# EAGLE design adapter 7seg_3dig (EAGLE 5.06)
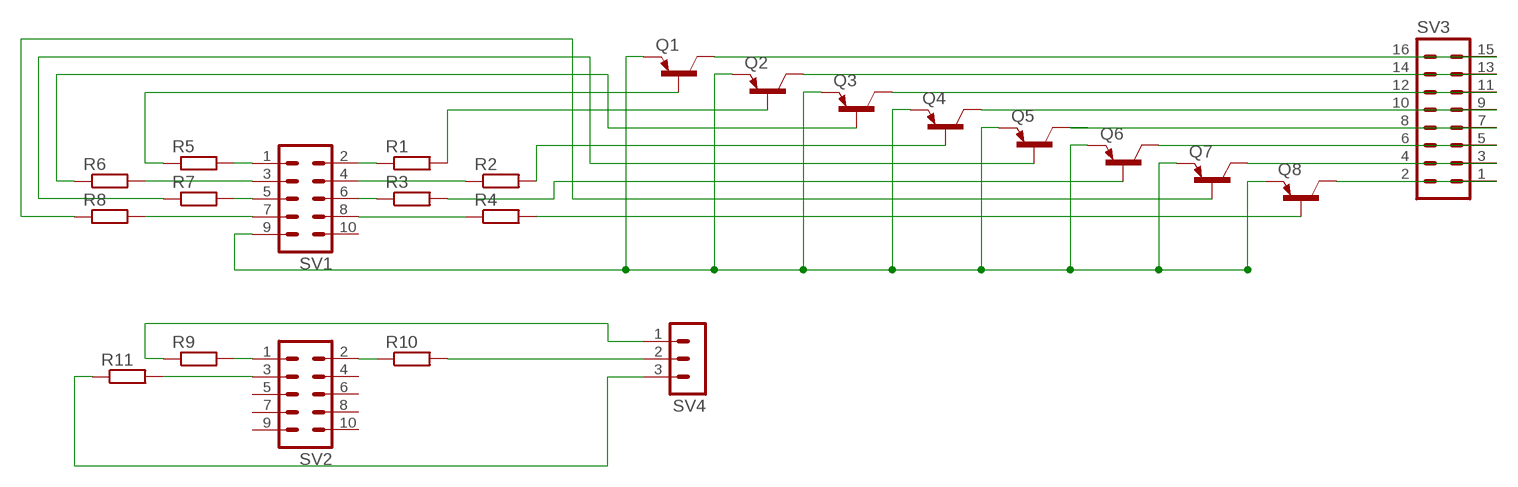
[diagram p0: schematic, sheet 1]

## Parts
Q1  BC807-16LT1SMD  [SOT23-BEC]
Q2  BC807-16LT1SMD  [SOT23-BEC]
Q3  BC807-16LT1SMD  [SOT23-BEC]
Q4  BC807-16LT1SMD  [SOT23-BEC]
Q5  BC807-16LT1SMD  [SOT23-BEC]
Q6  BC807-16LT1SMD  [SOT23-BEC]
Q7  BC807-16LT1SMD  [SOT23-BEC]
Q8  BC807-16LT1SMD  [SOT23-BEC]
R1  R-EU_R0805  [R0805]
R2  R-EU_R0805  [R0805]
R3  R-EU_R0805  [R0805]
R4  R-EU_R0805  [R0805]
R5  R-EU_R0805  [R0805]
R6  R-EU_R0805  [R0805]
R7  R-EU_R0805  [R0805]
R8  R-EU_R0805  [R0805]
R9  R-EU_R0805  [R0805]
R10  R-EU_R0805  [R0805]
R11  R-EU_R0805  [R0805]
SV1  MA05-2  [MA05-2]
SV2  MA05-2  [MA05-2]
SV3  MA08-2  [MA08-2]
SV4  MA03-1  [MA03-1]

## Nets
N$1: R5.2 SV1.1
N$2: R6.2 SV1.3
N$3: R7.2 SV1.5
N$4: R8.2 SV1.7
N$5: R1.1 SV1.2
N$6: R2.1 SV1.4
N$7: R3.1 SV1.6
N$8: R4.1 SV1.8
N$9: Q1.B R5.1
N$10: Q2.B R1.2
N$11: Q3.B R6.1
N$12: Q4.B R2.2
N$13: Q5.B R7.1
N$14: Q6.B R3.2
N$15: Q7.B R8.1
N$16: Q8.B R4.2
N$17: Q1.E Q2.E Q3.E Q4.E Q5.E Q6.E Q7.E Q8.E SV1.9
N$18: Q1.C SV3.15 SV3.16
N$19: Q2.C SV3.13 SV3.14
N$20: Q3.C SV3.11 SV3.12
N$21: Q4.C SV3.9 SV3.10
N$22: Q5.C SV3.7 SV3.8
N$23: Q6.C SV3.5 SV3.6
N$24: Q7.C SV3.3 SV3.4
N$25: Q8.C SV3.1 SV3.2
N$26: R9.2 SV2.1
N$27: R9.1 SV4.1
N$28: R10.1 SV2.2
N$29: R10.2 SV4.2
N$30: R11.2 SV2.3
N$31: R11.1 SV4.3
Unconnected: SV1.10 SV2.4 SV2.5 SV2.6 SV2.7 SV2.8 SV2.9 SV2.10

## Library data of the parts
Q1-Q8 = transistor-pnp:BC807*: PNP Transistror
R1-R11 = rcl:R-EU_: RESISTOR, European symbol
SV1 SV2 = con-lstb:MA05-2: PIN HEADER
SV3 = con-lstb:MA08-2: PIN HEADER
SV4 = con-lstb:MA03-1: PIN HEADER

## Board
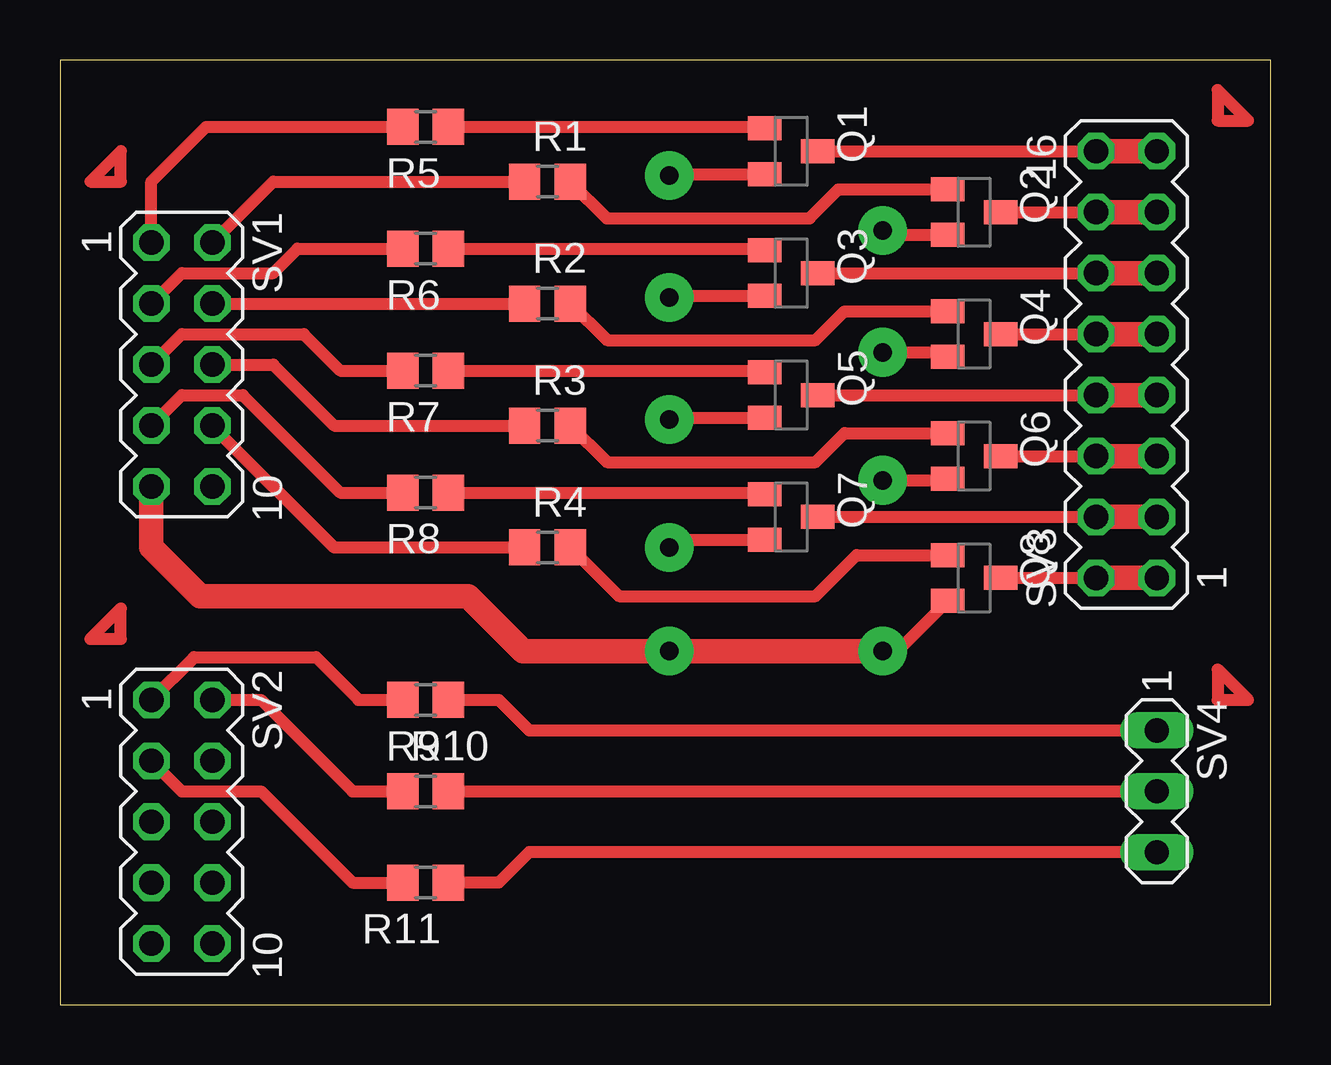
[diagram p1: board, top side]
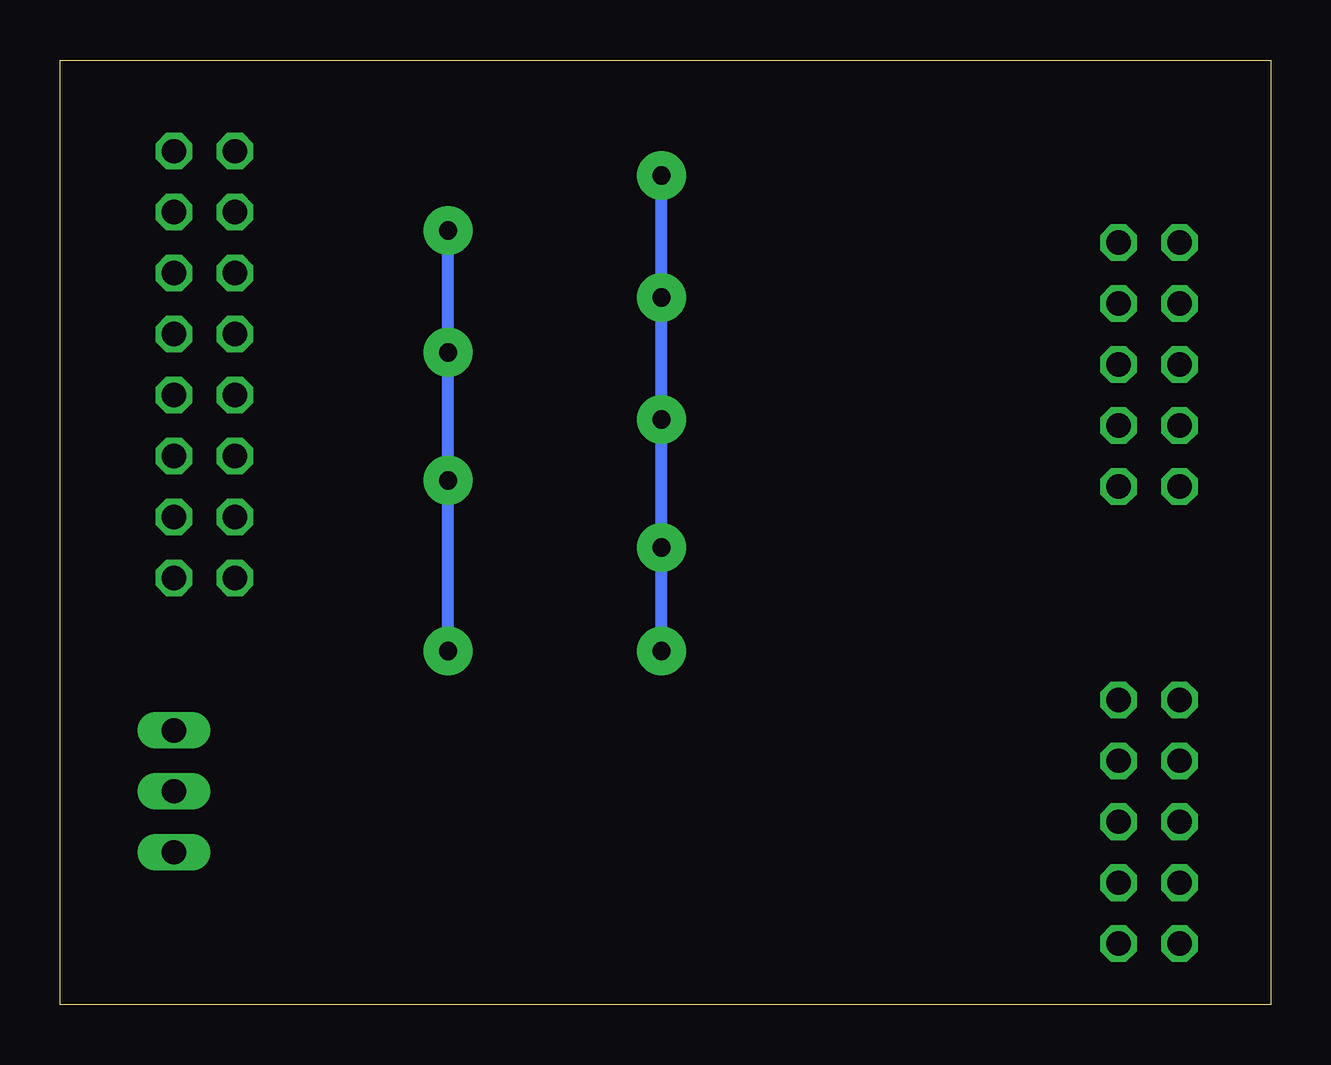
[diagram p2: board, bottom side, seen from below]

Size 50.47 x 39.36 mm. Coordinates in mm from the lower left corner, seen from the top.
Outline: 0,0 50.47,0 50.47,39.36 0,39.36 0,0
Copper layers (1*16): Top 0.035mm / dielectric 1.5mm / Bottom 0.035mm
Design rules "default": minimum track width 10mil, minimum drill 24mil, track to track 8mil, track to pad 8mil, pad to pad 8mil, via to via 8mil, smd to smd 8mil, copper to edge 40mil, drill to drill 8mil, minimum pad ring 10mil, minimum via ring 8mil, stop-mask expansion 4mil, vias tented up to drill 0mil, thermal gap 10mil

### Footprints (pad centres in the part's own frame; a part is rotated, then mirrored left to right if it is on the bottom)
SOT23-BEC = smd 1 x 1.4: B -0.95,-1.1; C 0,1.1; E 0.95,-1.1
R0805 = smd 1.3 x 1.5: 1 -0.95,0; 2 0.95,0
MA05-2 = drill 1.016 octagon: 1 -5.08,-1.27; 2 -5.08,1.27; 3 -2.54,-1.27; 4 -2.54,1.27; 5 0,-1.27; 6 0,1.27; 7 2.54,-1.27; 8 2.54,1.27; 9 5.08,-1.27; 10 5.08,1.27
MA08-2 = drill 1.016 octagon: 1 -8.89,-1.27; 2 -8.89,1.27; 3 -6.35,-1.27; 4 -6.35,1.27; 5 -3.81,-1.27; 6 -3.81,1.27; 7 -1.27,-1.27; 8 -1.27,1.27; 9 1.27,-1.27; 10 1.27,1.27; 11 3.81,-1.27; 12 3.81,1.27; 13 6.35,-1.27; 14 6.35,1.27; 15 8.89,-1.27; 16 8.89,1.27
MA03-1 = drill 1.016 long: 1 -2.54,0; 2 0,0; 3 2.54,0

### Placement (x,y rotation side)
Q1  30.48,35.56 270 top
Q2  38.1,33.02 270 top
Q3  30.48,30.48 270 top
Q4  38.1,27.94 270 top
Q5  30.48,25.4 270 top
Q6  38.1,22.86 270 top
Q7  30.48,20.32 270 top
Q8  38.1,17.78 270 top
R1  20.32,34.29 0 top
R2  20.32,29.21 0 top
R3  20.32,24.13 0 top
R4  20.32,19.05 0 top
R5  15.24,36.58 180 top
R6  15.24,31.5 180 top
R7  15.24,26.42 180 top
R8  15.24,21.34 180 top
R9  15.24,12.7 180 top
R10  15.24,8.89 0 top
R11  15.24,5.08 180 top
SV1  5.08,26.67 270 top
SV2  5.08,7.62 270 top
SV3  44.45,26.67 90 top
SV4  45.72,8.89 270 top

### Tracks (layer width: path | path; a pad name or v marks a point on that pad's centre or on a via)
N$1
  Top 0.508: SV1.1 3.81,34.29 6.1,36.58 R5.2
N$2
  Top 0.508: SV1.3 5.08,30.48 8.89,30.48 9.91,31.5 R6.2
N$3
  Top 0.508: SV1.5 5.08,27.94 10.16,27.94 11.68,26.42 R7.2
N$4
  Top 0.508: SV1.7 5.08,25.4 7.62,25.4 11.68,21.34 R8.2
N$5
  Top 0.508: SV1.2 8.89,34.29 R1.1
N$6
  Top 0.508: SV1.4 R2.1
N$7
  Top 0.508: SV1.6 8.89,26.67 11.43,24.13 R3.1
N$8
  Top 0.508: SV1.8 11.43,19.05 R4.1
N$9
  Top 0.508: R5.1 29.31,36.58 Q1.B
N$10
  Top 0.508: R1.2 22.79,32.77 31.24,32.77 32.45,33.97 Q2.B
N$11
  Top 0.508: R6.1 29.31,31.5 Q3.B
N$12
  Top 0.508: R2.2 22.79,27.69 31.5,27.69 32.7,28.89 Q4.B
N$13
  Top 0.508: R7.1 29.31,26.42 Q5.B
N$14
  Top 0.508: R3.2 22.79,22.61 31.5,22.61 32.7,23.81 Q6.B
N$15
  Top 0.508: R8.1 29.31,21.34 Q7.B
N$16
  Top 0.508: R4.2 23.3,17.02 31.5,17.02 33.21,18.73 Q8.B
N$17  (via drill 0.76 pad 2.03)
  Top 0.508: 3.81,21.34 SV1.9 | Q1.E 25.47,34.61 v25.4,34.54 | Q3.E 25.47,29.53 v25.4,29.46 | Q5.E 25.47,24.45 v25.4,24.38 | Q7.E 25.72,19.37 v25.4,19.05 | 19.3,14.73 v25.4,14.73 v34.29,14.73 34.54,14.73 34.9,14.73 Q8.E | Q2.E 34.48,32.07 v34.29,32.26 | Q4.E 37,27.18 v34.29,27.18 | Q6.E 37,21.84 v34.29,21.84
  Top 1.016: 3.81,21.34 3.81,19.05 5.84,17.02 17.02,17.02 19.3,14.73 34.54,14.73
  Bottom 0.508: v25.4,14.73 v25.4,19.05 v25.4,24.38 v25.4,29.46 v25.4,34.54 | v34.29,14.73 v34.29,21.84 v34.29,27.18 v34.29,32.26
N$18
  Top 0.508: Q1.C SV3.16 SV3.15
  Top 1.016: SV3.15 SV3.16
N$19
  Top 0.508: Q2.C SV3.14 SV3.13
  Top 1.016: SV3.14 SV3.13
N$20
  Top 0.508: Q3.C SV3.12 SV3.11
  Top 1.016: SV3.12 SV3.11
N$21
  Top 0.508: Q4.C SV3.10 SV3.9
  Top 1.016: SV3.10 SV3.9
N$22
  Top 0.508: Q5.C SV3.8 SV3.7
  Top 1.016: SV3.8 SV3.7
N$23
  Top 0.508: Q6.C SV3.6 SV3.5
  Top 1.016: SV3.6 SV3.5
N$24
  Top 0.508: Q7.C SV3.4 SV3.3
  Top 1.016: SV3.4 SV3.3
N$25
  Top 0.508: Q8.C SV3.2 SV3.1
  Top 1.016: SV3.2 SV3.1
N$26
  Top 0.508: SV2.1 5.59,14.48 10.67,14.48 12.45,12.7 R9.2
N$27
  Top 0.508: R9.1 18.29,12.7 19.56,11.43 SV4.1
N$28
  Top 0.508: SV2.2 8.38,12.7 12.19,8.89 R10.1
N$29
  Top 0.508: R10.2 SV4.2
N$30
  Top 0.508: SV2.3 5.08,8.89 8.38,8.89 12.19,5.08 R11.2
N$31
  Top 0.508: SV4.3 19.56,6.35 18.29,5.08 R11.1
N$32
  Top 0.508: 1.27,34.29 2.54,34.29 2.54,35.56 1.27,34.29
N$33
  Top 0.508: 2.54,15.24 2.54,16.51 1.27,15.24 2.54,15.24
N$34
  Top 0.508: 48.26,38.1 48.26,36.83 49.53,36.83 48.26,38.1
N$35
  Top 0.508: 48.26,13.97 48.26,12.7 49.53,12.7 48.26,13.97